# Altium schematic sheet AFPGA.SchDoc: Application FPGA
size 594 x 420 mm; CheckedBy: T.Janicki; CompanyName: Creotech Instruments SA; DrawnBy: G.Kasprowicz; Organization: CERN; Address1: European Organization for Nuclear Research; Address2: CH-1211 Genève 23 - Switzerland; Revision: -; SheetNumber: 7; SheetTotal: 11; EDA_Number: EDA-xxxx; Projet: Simple VME FMC Carrier; ModifiedBy: -; CreateDate: 20/11/2012; CheckedDate: 23/01/2012; DivGrp: BE-CO; Designer: G.Kasprowicz; PageSetup: Record=PageOptions|CenterHorizontal=True|CenterVertical=True|PrintScale=0.67|XCorrection=1.00|YCorrection=1.00|PrintKind=1|BorderSize=5000000|LeftOffset=0|BottomOffset=0|Orientation=2|PaperLength=1000|PaperWidth=1000|Scale=100|PaperSource=15|PrintQuality=600|MediaType=1|DitherType=10|PaperKind=A3|PrintScaleMode=1; ModifiedDate: -
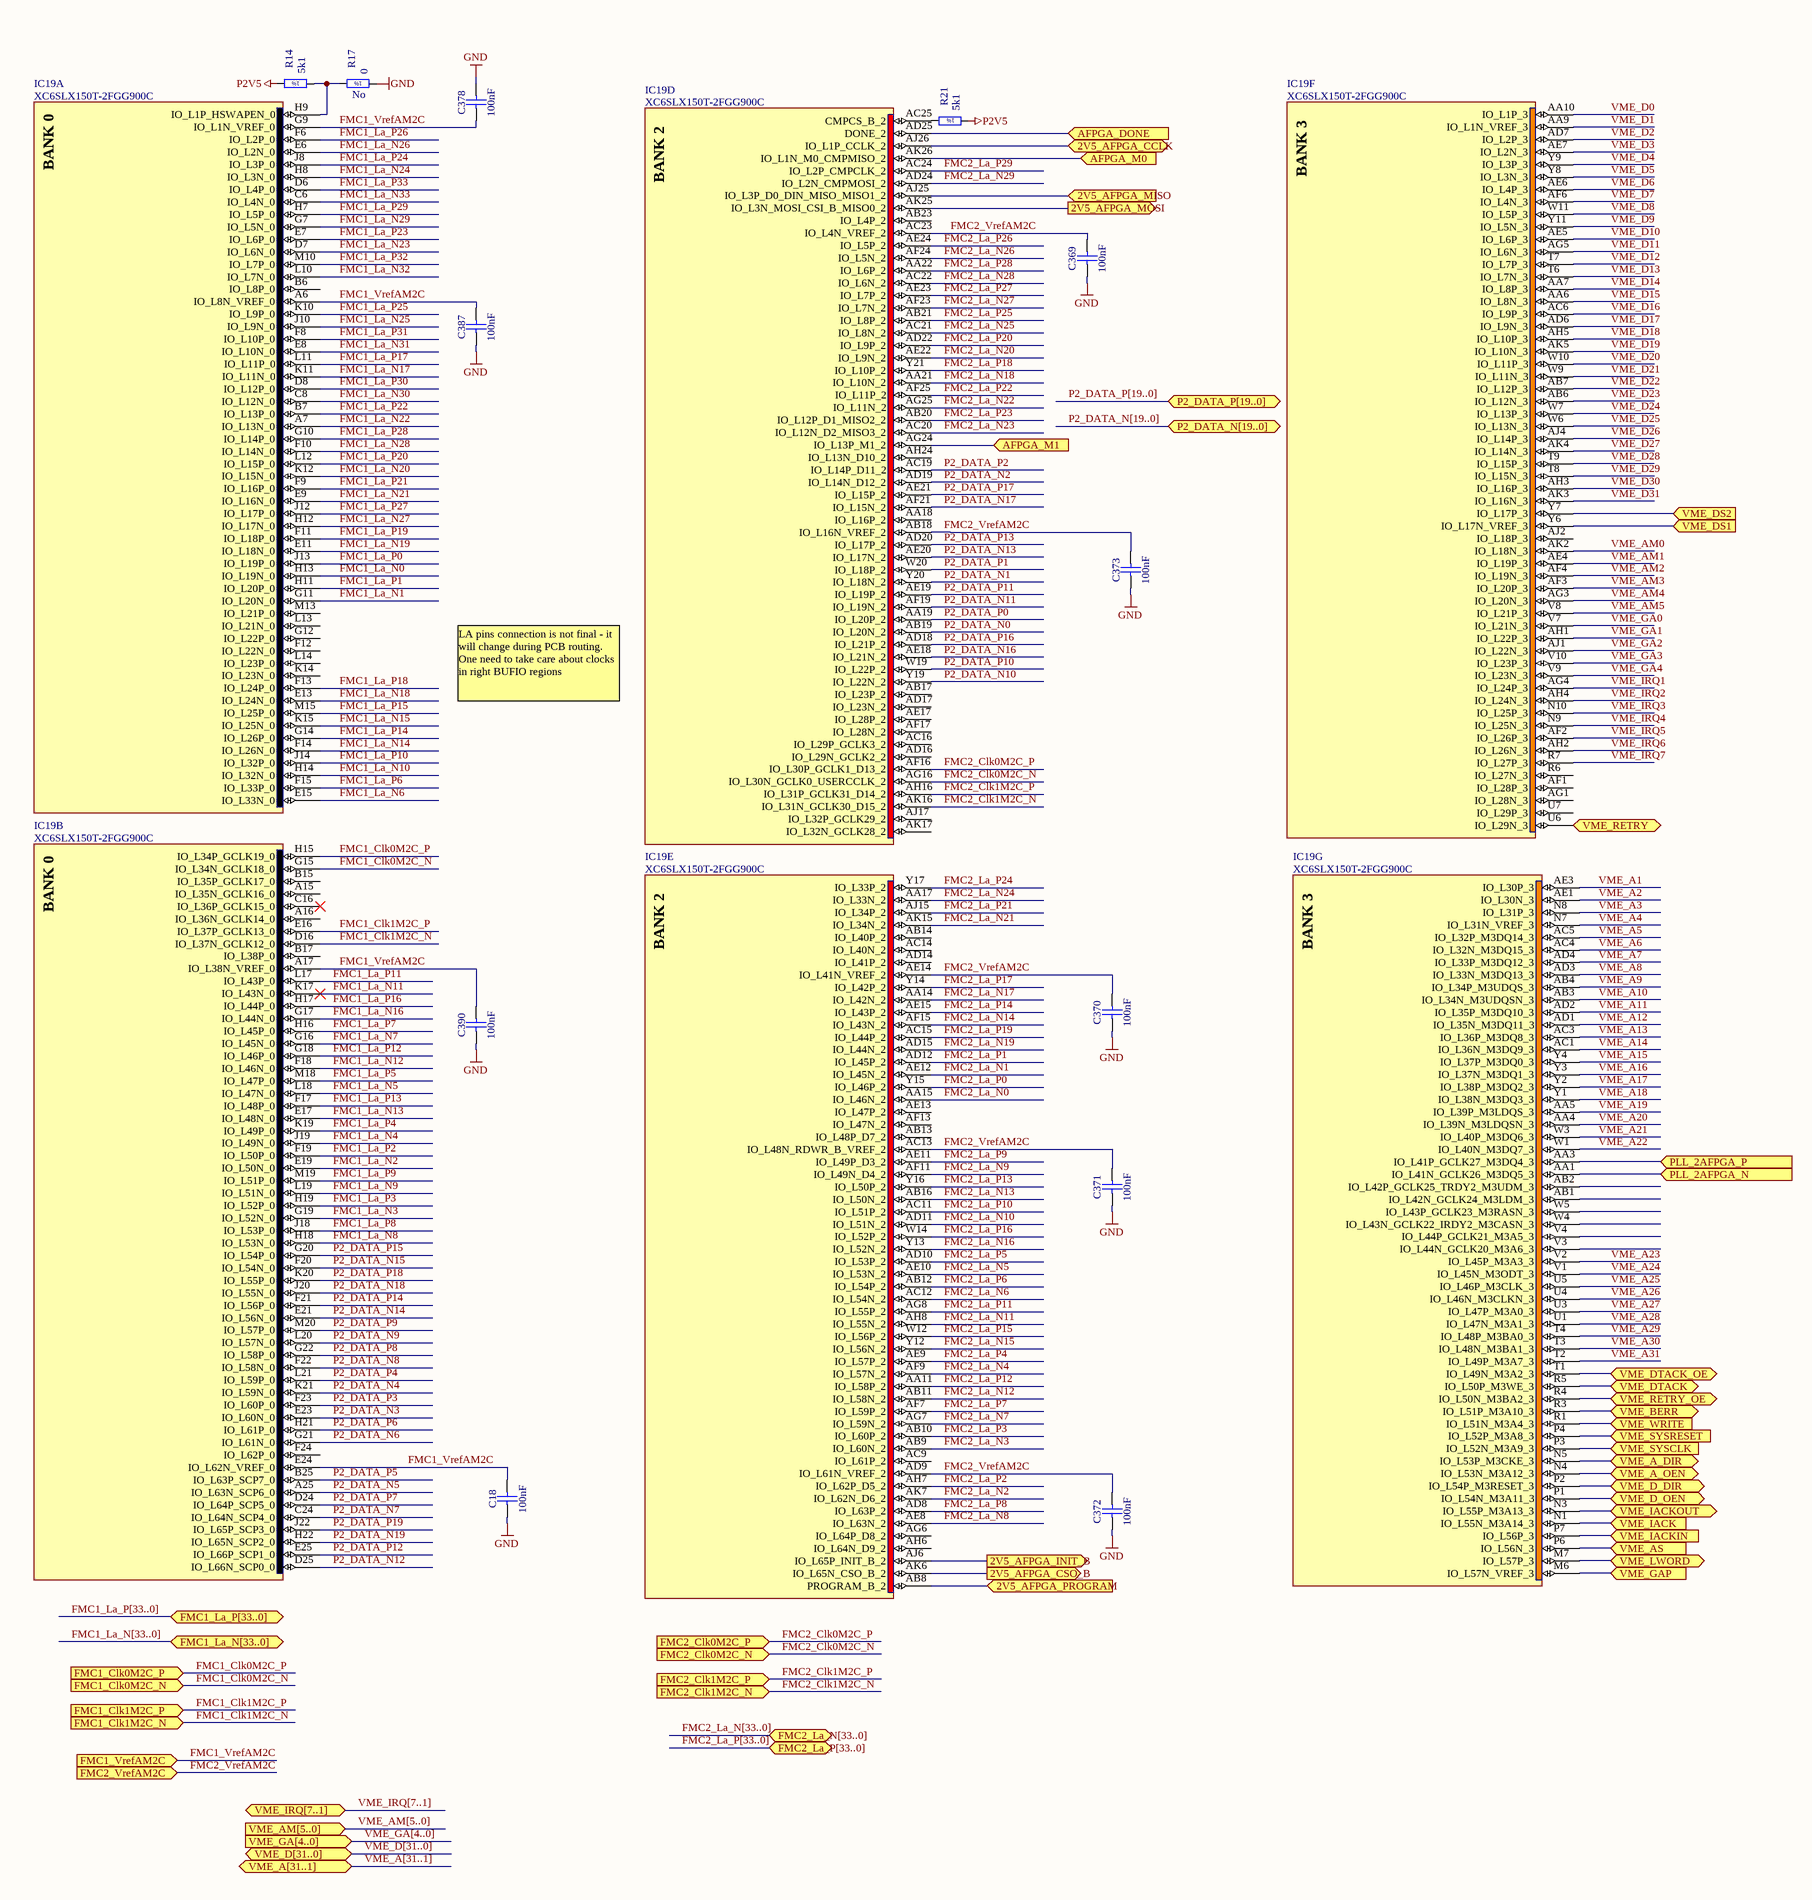
[diagram p0: AFPGA.SchDoc, left]
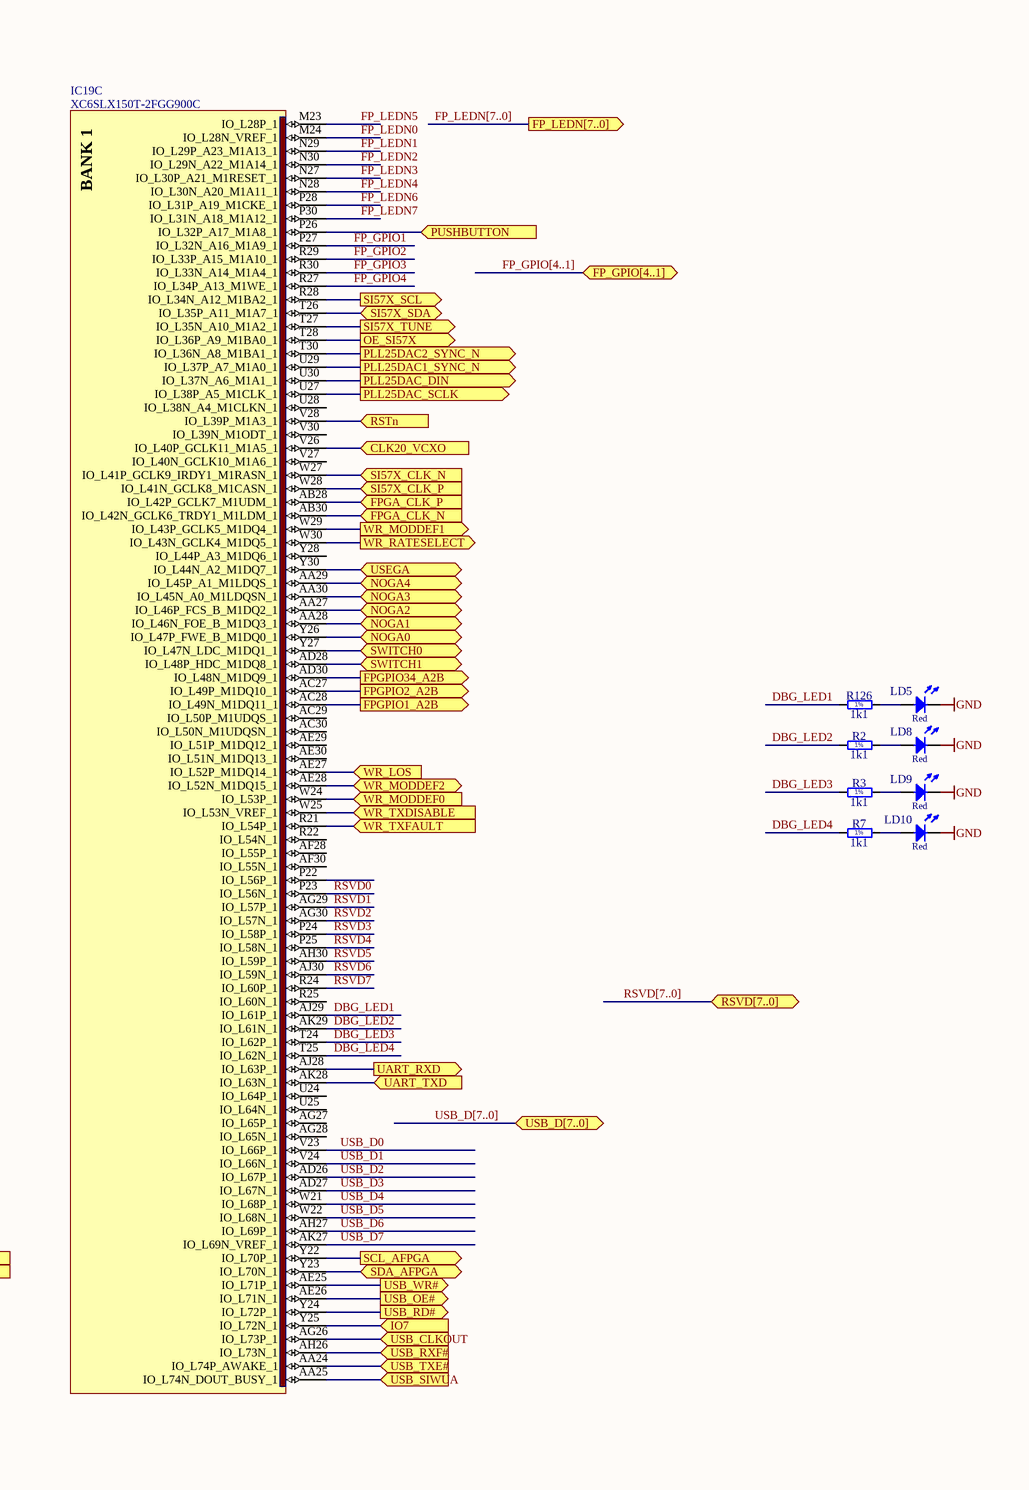
[diagram p1: AFPGA.SchDoc, right]

## Parts
C18  100nF  [CAPC1005X55N]
C369  100nF  [CAPC1005X55N]
C370  100nF  [CAPC1005X55N]
C371  100nF  [CAPC1005X55N]
C372  100nF  [CAPC1005X55N]
C373  100nF  [CAPC1005X55N]
C378  100nF  [CAPC1005X55N]
C387  100nF  [CAPC1005X55N]
C390  100nF  [CAPC1005X55N]
IC19  XC6SLX150T-2FGG900C  [BGA900C100P30X30_3100X3100X260]  (parts A,B,C,D,E,F,G of 18)
LD5  Red  [LEDC1608X80N_RED]  (value not drawn)
LD8  Red  [LEDC1608X80N_RED]  (value not drawn)
LD9  Red  [LEDC1608X80N_RED]  (value not drawn)
LD10  Red  [LEDC1608X80N_RED]  (value not drawn)
R2  1k1  [RESC1608X55N]
R3  1k1  [RESC1608X55N]
R7  1k1  [RESC1608X55N]
R14  5k1  [RESC1608X55N]
R17  0  Mounted: No  [RESC1608X55N]
R21  5k1  [RESC1608X55N]
R126  1k1  [RESC1608X55N]

## Ports
2V5_AFPGA_CCLK (bidir), 2V5_AFPGA_CSO_B (out), 2V5_AFPGA_INIT_B (out), 2V5_AFPGA_MISO (in), 2V5_AFPGA_MOSI (out), 2V5_AFPGA_PROGRAM (in), AFPGA_DONE (in), AFPGA_M0 (in), AFPGA_M1 (in), CLK20_VCXO (in), FMC1_Clk0M2C_N (in), FMC1_Clk0M2C_P (in), FMC1_Clk1M2C_N (in), FMC1_Clk1M2C_P (in), FMC1_La_N[33..0] (bidir), FMC1_La_P[33..0] (bidir), FMC1_VrefAM2C (in), FMC2_Clk0M2C_N (in), FMC2_Clk0M2C_P (in), FMC2_Clk1M2C_N (in), FMC2_Clk1M2C_P (in), FMC2_La_N[33..0] (bidir), FMC2_La_P[33..0] (bidir), FMC2_VrefAM2C (in), FP_GPIO[4..1] (bidir), FP_LEDN[7..0] (out), FPGA_CLK_N (in), FPGA_CLK_P (in), FPGPIO1_A2B (out), FPGPIO2_A2B (out), FPGPIO34_A2B (out), IO7 (in), NOGA0 (bidir), NOGA1 (bidir), NOGA2 (bidir), NOGA3 (bidir), NOGA4 (bidir), OE_SI57X (out), P2_DATA_N[19..0] (bidir), P2_DATA_P[19..0] (bidir), PLL25DAC1_SYNC_N (out), PLL25DAC2_SYNC_N (out), PLL25DAC_DIN (out), PLL25DAC_SCLK (out), PLL_2AFPGA_N (in), PLL_2AFPGA_P (in), PUSHBUTTON (in), RSTn (in), RSVD[7..0] (bidir), SCL_AFPGA (out), SDA_AFPGA (bidir), SI57X_CLK_N (in), SI57X_CLK_P (in), SI57X_SCL (out), SI57X_SDA (bidir), SI57X_TUNE (out), SWITCH0 (bidir), SWITCH1 (bidir), UART_RXD (out), UART_TXD (in), USB_CLKOUT (in), USB_D[7..0] (bidir), USB_OE# (out), USB_RD# (out), USB_RXF# (in), USB_SIWUA (in), USB_TXE# (in), USB_WR# (out), USEGA (bidir), VME_A[31..1] (bidir), VME_A_DIR (bidir), VME_A_OEN (bidir), VME_AM[5..0] (in), VME_AS (in), VME_BERR (bidir), VME_D[31..0] (bidir), VME_D_DIR (bidir), VME_D_OEN (bidir), VME_DS1 (in), VME_DS2 (in), VME_DTACK (bidir), VME_DTACK_OE (bidir), VME_GA[4..0] (in), VME_GAP (in), VME_IACK (in), VME_IACKIN (in), VME_IACKOUT (bidir), VME_IRQ[7..1] (bidir), VME_LWORD (bidir), VME_RETRY (in), VME_RETRY_OE (bidir), VME_SYSCLK (in), VME_SYSRESET (in), VME_WRITE (in), WR_LOS (in), WR_MODDEF0 (in), WR_MODDEF1 (out), WR_MODDEF2 (bidir), WR_RATESELECT (out), WR_TXDISABLE (in), WR_TXFAULT (in)

## Nets
GND: C18.1 C369.1 C370.1 C371.1 C372.1 C373.1 C378.2 C387.1 C390.1 LD5.1(C) LD8.1(C) LD9.1(C) LD10.1(C) R17.1
P2V5: R14.2 R21.1
2V5_AFPGA_CCLK: IC19.AJ26(IO_L1P_CCLK_2) ; port 2V5_AFPGA_CCLK
2V5_AFPGA_CSO_B: IC19.AK6(IO_L65N_CSO_B_2) ; port 2V5_AFPGA_CSO_B
2V5_AFPGA_INIT_B: IC19.AJ6(IO_L65P_INIT_B_2) ; port 2V5_AFPGA_INIT_B
2V5_AFPGA_MISO: IC19.AJ25(IO_L3P_D0_DIN_MISO_MISO1_2) ; port 2V5_AFPGA_MISO
2V5_AFPGA_MOSI: IC19.AK25(IO_L3N_MOSI_CSI_B_MISO0_2) ; port 2V5_AFPGA_MOSI
2V5_AFPGA_PROGRAM: IC19.AB8(PROGRAM_B_2) ; port 2V5_AFPGA_PROGRAM
AFPGA_DONE: IC19.AD25(DONE_2) ; port AFPGA_DONE
AFPGA_M0: IC19.AK26(IO_L1N_M0_CMPMISO_2) ; port AFPGA_M0
AFPGA_M1: IC19.AG24(IO_L13P_M1_2) ; port AFPGA_M1
CLK20_VCXO: IC19.V26(IO_L40P_GCLK11_M1A5_1) ; port CLK20_VCXO
DBG_LED1: IC19.AJ29(IO_L61P_1) R126.1
DBG_LED2: IC19.AK29(IO_L61N_1) R2.1
DBG_LED3: IC19.T24(IO_L62P_1) R3.1
DBG_LED4: IC19.T25(IO_L62N_1) R7.1
FMC1_Clk0M2C_N: IC19.G15(IO_L34N_GCLK18_0) ; port FMC1_Clk0M2C_N
FMC1_Clk0M2C_P: IC19.H15(IO_L34P_GCLK19_0) ; port FMC1_Clk0M2C_P
FMC1_Clk1M2C_N: IC19.D16(IO_L37N_GCLK12_0) ; port FMC1_Clk1M2C_N
FMC1_Clk1M2C_P: IC19.E16(IO_L37P_GCLK13_0) ; port FMC1_Clk1M2C_P
FMC1_La_N0: IC19.H13(IO_L19N_0)
FMC1_La_N1: IC19.G11(IO_L20N_0)
FMC1_La_N2: IC19.E19(IO_L50N_0)
FMC1_La_N3: IC19.G19(IO_L52N_0)
FMC1_La_N4: IC19.J19(IO_L49N_0)
FMC1_La_N5: IC19.L18(IO_L47N_0)
FMC1_La_N6: IC19.E15(IO_L33N_0)
FMC1_La_N7: IC19.G16(IO_L45N_0)
FMC1_La_N8: IC19.H18(IO_L53N_0)
FMC1_La_N9: IC19.L19(IO_L51N_0)
FMC1_La_N10: IC19.H14(IO_L32N_0)
FMC1_La_N11: IC19.K17(IO_L43N_0)
FMC1_La_N12: IC19.F18(IO_L46N_0)
FMC1_La_N13: IC19.E17(IO_L48N_0)
FMC1_La_N14: IC19.F14(IO_L26N_0)
FMC1_La_N15: IC19.K15(IO_L25N_0)
FMC1_La_N16: IC19.G17(IO_L44N_0)
FMC1_La_N17: IC19.K11(IO_L11N_0)
FMC1_La_N18: IC19.E13(IO_L24N_0)
FMC1_La_N19: IC19.E11(IO_L18N_0)
FMC1_La_N20: IC19.K12(IO_L15N_0)
FMC1_La_N21: IC19.E9(IO_L16N_0)
FMC1_La_N22: IC19.A7(IO_L13N_0)
FMC1_La_N23: IC19.D7(IO_L6N_0)
FMC1_La_N24: IC19.H8(IO_L3N_0)
FMC1_La_N25: IC19.J10(IO_L9N_0)
FMC1_La_N26: IC19.E6(IO_L2N_0)
FMC1_La_N27: IC19.H12(IO_L17N_0)
FMC1_La_N28: IC19.F10(IO_L14N_0)
FMC1_La_N29: IC19.G7(IO_L5N_0)
FMC1_La_N30: IC19.C8(IO_L12N_0)
FMC1_La_N31: IC19.E8(IO_L10N_0)
FMC1_La_N32: IC19.L10(IO_L7N_0)
FMC1_La_N33: IC19.C6(IO_L4N_0)
FMC1_La_P0: IC19.J13(IO_L19P_0)
FMC1_La_P1: IC19.H11(IO_L20P_0)
FMC1_La_P2: IC19.F19(IO_L50P_0)
FMC1_La_P3: IC19.H19(IO_L52P_0)
FMC1_La_P4: IC19.K19(IO_L49P_0)
FMC1_La_P5: IC19.M18(IO_L47P_0)
FMC1_La_P6: IC19.F15(IO_L33P_0)
FMC1_La_P7: IC19.H16(IO_L45P_0)
FMC1_La_P8: IC19.J18(IO_L53P_0)
FMC1_La_P9: IC19.M19(IO_L51P_0)
FMC1_La_P10: IC19.J14(IO_L32P_0)
FMC1_La_P11: IC19.L17(IO_L43P_0)
FMC1_La_P12: IC19.G18(IO_L46P_0)
FMC1_La_P13: IC19.F17(IO_L48P_0)
FMC1_La_P14: IC19.G14(IO_L26P_0)
FMC1_La_P15: IC19.M15(IO_L25P_0)
FMC1_La_P16: IC19.H17(IO_L44P_0)
FMC1_La_P17: IC19.L11(IO_L11P_0)
FMC1_La_P18: IC19.F13(IO_L24P_0)
FMC1_La_P19: IC19.F11(IO_L18P_0)
FMC1_La_P20: IC19.L12(IO_L15P_0)
FMC1_La_P21: IC19.F9(IO_L16P_0)
FMC1_La_P22: IC19.B7(IO_L13P_0)
FMC1_La_P23: IC19.E7(IO_L6P_0)
FMC1_La_P24: IC19.J8(IO_L3P_0)
FMC1_La_P25: IC19.K10(IO_L9P_0)
FMC1_La_P26: IC19.F6(IO_L2P_0)
FMC1_La_P27: IC19.J12(IO_L17P_0)
FMC1_La_P28: IC19.G10(IO_L14P_0)
FMC1_La_P29: IC19.H7(IO_L5P_0)
FMC1_La_P30: IC19.D8(IO_L12P_0)
FMC1_La_P31: IC19.F8(IO_L10P_0)
FMC1_La_P32: IC19.M10(IO_L7P_0)
FMC1_La_P33: IC19.D6(IO_L4P_0)
FMC1_VrefAM2C: C18.2 C378.1 C387.2 C390.2 IC19.A6(IO_L8N_VREF_0) IC19.A17(IO_L38N_VREF_0) IC19.E24(IO_L62N_VREF_0) IC19.G9(IO_L1N_VREF_0) ; port FMC1_VrefAM2C
FMC2_Clk0M2C_N: IC19.AG16(IO_L30N_GCLK0_USERCCLK_2) ; port FMC2_Clk0M2C_N
FMC2_Clk0M2C_P: IC19.AF16(IO_L30P_GCLK1_D13_2) ; port FMC2_Clk0M2C_P
FMC2_Clk1M2C_N: IC19.AK16(IO_L31N_GCLK30_D15_2) ; port FMC2_Clk1M2C_N
FMC2_Clk1M2C_P: IC19.AH16(IO_L31P_GCLK31_D14_2) ; port FMC2_Clk1M2C_P
FMC2_La_N0: IC19.AA15(IO_L46N_2)
FMC2_La_N1: IC19.AE12(IO_L45N_2)
FMC2_La_N2: IC19.AK7(IO_L62N_D6_2)
FMC2_La_N3: IC19.AB9(IO_L60N_2)
FMC2_La_N4: IC19.AF9(IO_L57N_2)
FMC2_La_N5: IC19.AE10(IO_L53N_2)
FMC2_La_N6: IC19.AC12(IO_L54N_2)
FMC2_La_N7: IC19.AG7(IO_L59N_2)
FMC2_La_N8: IC19.AE8(IO_L63N_2)
FMC2_La_N9: IC19.AF11(IO_L49N_D4_2)
FMC2_La_N10: IC19.AD11(IO_L51N_2)
FMC2_La_N11: IC19.AH8(IO_L55N_2)
FMC2_La_N12: IC19.AB11(IO_L58N_2)
FMC2_La_N13: IC19.AB16(IO_L50N_2)
FMC2_La_N14: IC19.AF15(IO_L43N_2)
FMC2_La_N15: IC19.Y12(IO_L56N_2)
FMC2_La_N16: IC19.Y13(IO_L52N_2)
FMC2_La_N17: IC19.AA14(IO_L42N_2)
FMC2_La_N18: IC19.AA21(IO_L10N_2)
FMC2_La_N19: IC19.AD15(IO_L44N_2)
FMC2_La_N20: IC19.AE22(IO_L9N_2)
FMC2_La_N21: IC19.AK15(IO_L34N_2)
FMC2_La_N22: IC19.AG25(IO_L11N_2)
FMC2_La_N23: IC19.AC20(IO_L12N_D2_MISO3_2)
FMC2_La_N24: IC19.AA17(IO_L33N_2)
FMC2_La_N25: IC19.AC21(IO_L8N_2)
FMC2_La_N26: IC19.AF24(IO_L5N_2)
FMC2_La_N27: IC19.AF23(IO_L7N_2)
FMC2_La_N28: IC19.AC22(IO_L6N_2)
FMC2_La_N29: IC19.AD24(IO_L2N_CMPMOSI_2)
FMC2_La_P0: IC19.Y15(IO_L46P_2)
FMC2_La_P1: IC19.AD12(IO_L45P_2)
FMC2_La_P2: IC19.AH7(IO_L62P_D5_2)
FMC2_La_P3: IC19.AB10(IO_L60P_2)
FMC2_La_P4: IC19.AE9(IO_L57P_2)
FMC2_La_P5: IC19.AD10(IO_L53P_2)
FMC2_La_P6: IC19.AB12(IO_L54P_2)
FMC2_La_P7: IC19.AF7(IO_L59P_2)
FMC2_La_P8: IC19.AD8(IO_L63P_2)
FMC2_La_P9: IC19.AE11(IO_L49P_D3_2)
FMC2_La_P10: IC19.AC11(IO_L51P_2)
FMC2_La_P11: IC19.AG8(IO_L55P_2)
FMC2_La_P12: IC19.AA11(IO_L58P_2)
FMC2_La_P13: IC19.Y16(IO_L50P_2)
FMC2_La_P14: IC19.AE15(IO_L43P_2)
FMC2_La_P15: IC19.W12(IO_L56P_2)
FMC2_La_P16: IC19.W14(IO_L52P_2)
FMC2_La_P17: IC19.Y14(IO_L42P_2)
FMC2_La_P18: IC19.Y21(IO_L10P_2)
FMC2_La_P19: IC19.AC15(IO_L44P_2)
FMC2_La_P20: IC19.AD22(IO_L9P_2)
FMC2_La_P21: IC19.AJ15(IO_L34P_2)
FMC2_La_P22: IC19.AF25(IO_L11P_2)
FMC2_La_P23: IC19.AB20(IO_L12P_D1_MISO2_2)
FMC2_La_P24: IC19.Y17(IO_L33P_2)
FMC2_La_P25: IC19.AB21(IO_L8P_2)
FMC2_La_P26: IC19.AE24(IO_L5P_2)
FMC2_La_P27: IC19.AE23(IO_L7P_2)
FMC2_La_P28: IC19.AA22(IO_L6P_2)
FMC2_La_P29: IC19.AC24(IO_L2P_CMPCLK_2)
FMC2_VrefAM2C: C369.2 C370.2 C371.2 C372.2 C373.2 IC19.AB18(IO_L16N_VREF_2) IC19.AC13(IO_L48N_RDWR_B_VREF_2) IC19.AC23(IO_L4N_VREF_2) IC19.AD9(IO_L61N_VREF_2) IC19.AE14(IO_L41N_VREF_2) ; port FMC2_VrefAM2C
FP_GPIO1: IC19.P27(IO_L32N_A16_M1A9_1)
FP_GPIO2: IC19.R29(IO_L33P_A15_M1A10_1)
FP_GPIO3: IC19.R30(IO_L33N_A14_M1A4_1)
FP_GPIO4: IC19.R27(IO_L34P_A13_M1WE_1)
FP_LEDN0: IC19.M24(IO_L28N_VREF_1)
FP_LEDN1: IC19.N29(IO_L29P_A23_M1A13_1)
FP_LEDN2: IC19.N30(IO_L29N_A22_M1A14_1)
FP_LEDN3: IC19.N27(IO_L30P_A21_M1RESET_1)
FP_LEDN4: IC19.N28(IO_L30N_A20_M1A11_1)
FP_LEDN5: IC19.M23(IO_L28P_1)
FP_LEDN6: IC19.P28(IO_L31P_A19_M1CKE_1)
FP_LEDN7: IC19.P30(IO_L31N_A18_M1A12_1)
FPGA_CLK_N: IC19.AB30(IO_L42N_GCLK6_TRDY1_M1LDM_1) ; port FPGA_CLK_N
FPGA_CLK_P: IC19.AB28(IO_L42P_GCLK7_M1UDM_1) ; port FPGA_CLK_P
FPGPIO1_A2B: IC19.AC28(IO_L49N_M1DQ11_1) ; port FPGPIO1_A2B
FPGPIO2_A2B: IC19.AC27(IO_L49P_M1DQ10_1) ; port FPGPIO2_A2B
FPGPIO34_A2B: IC19.AD30(IO_L48N_M1DQ9_1) ; port FPGPIO34_A2B
IO7: IC19.Y25(IO_L72N_1) ; port IO7
NOGA0: IC19.Y26(IO_L47P_FWE_B_M1DQ0_1) ; port NOGA0
NOGA1: IC19.AA28(IO_L46N_FOE_B_M1DQ3_1) ; port NOGA1
NOGA2: IC19.AA27(IO_L46P_FCS_B_M1DQ2_1) ; port NOGA2
NOGA3: IC19.AA30(IO_L45N_A0_M1LDQSN_1) ; port NOGA3
NOGA4: IC19.AA29(IO_L45P_A1_M1LDQS_1) ; port NOGA4
OE_SI57X: IC19.T28(IO_L36P_A9_M1BA0_1) ; port OE_SI57X
P2_DATA_N0: IC19.AB19(IO_L20N_2)
P2_DATA_N1: IC19.Y20(IO_L18N_2)
P2_DATA_N2: IC19.AD19(IO_L14N_D12_2)
P2_DATA_N3: IC19.E23(IO_L60N_0)
P2_DATA_N4: IC19.K21(IO_L59N_0)
P2_DATA_N5: IC19.A25(IO_L63N_SCP6_0)
P2_DATA_N6: IC19.G21(IO_L61N_0)
P2_DATA_N7: IC19.C24(IO_L64N_SCP4_0)
P2_DATA_N8: IC19.F22(IO_L58N_0)
P2_DATA_N9: IC19.L20(IO_L57N_0)
P2_DATA_N10: IC19.Y19(IO_L22N_2)
P2_DATA_N11: IC19.AF19(IO_L19N_2)
P2_DATA_N12: IC19.D25(IO_L66N_SCP0_0)
P2_DATA_N13: IC19.AE20(IO_L17N_2)
P2_DATA_N14: IC19.E21(IO_L56N_0)
P2_DATA_N15: IC19.F20(IO_L54N_0)
P2_DATA_N16: IC19.AE18(IO_L21N_2)
P2_DATA_N17: IC19.AF21(IO_L15N_2)
P2_DATA_N18: IC19.J20(IO_L55N_0)
P2_DATA_N19: IC19.H22(IO_L65N_SCP2_0)
P2_DATA_P0: IC19.AA19(IO_L20P_2)
P2_DATA_P1: IC19.W20(IO_L18P_2)
P2_DATA_P2: IC19.AC19(IO_L14P_D11_2)
P2_DATA_P3: IC19.F23(IO_L60P_0)
P2_DATA_P4: IC19.L21(IO_L59P_0)
P2_DATA_P5: IC19.B25(IO_L63P_SCP7_0)
P2_DATA_P6: IC19.H21(IO_L61P_0)
P2_DATA_P7: IC19.D24(IO_L64P_SCP5_0)
P2_DATA_P8: IC19.G22(IO_L58P_0)
P2_DATA_P9: IC19.M20(IO_L57P_0)
P2_DATA_P10: IC19.W19(IO_L22P_2)
P2_DATA_P11: IC19.AE19(IO_L19P_2)
P2_DATA_P12: IC19.E25(IO_L66P_SCP1_0)
P2_DATA_P13: IC19.AD20(IO_L17P_2)
P2_DATA_P14: IC19.F21(IO_L56P_0)
P2_DATA_P15: IC19.G20(IO_L54P_0)
P2_DATA_P16: IC19.AD18(IO_L21P_2)
P2_DATA_P17: IC19.AE21(IO_L15P_2)
P2_DATA_P18: IC19.K20(IO_L55P_0)
P2_DATA_P19: IC19.J22(IO_L65P_SCP3_0)
PLL25DAC1_SYNC_N: IC19.U29(IO_L37P_A7_M1A0_1) ; port PLL25DAC1_SYNC_N
PLL25DAC2_SYNC_N: IC19.T30(IO_L36N_A8_M1BA1_1) ; port PLL25DAC2_SYNC_N
PLL25DAC_DIN: IC19.U30(IO_L37N_A6_M1A1_1) ; port PLL25DAC_DIN
PLL25DAC_SCLK: IC19.U27(IO_L38P_A5_M1CLK_1) ; port PLL25DAC_SCLK
PLL_2AFPGA_N: IC19.AA1(IO_L41N_GCLK26_M3DQ5_3) ; port PLL_2AFPGA_N
PLL_2AFPGA_P: IC19.AA3(IO_L41P_GCLK27_M3DQ4_3) ; port PLL_2AFPGA_P
PUSHBUTTON: IC19.P26(IO_L32P_A17_M1A8_1) ; port PUSHBUTTON
RSTn: IC19.V28(IO_L39P_M1A3_1) ; port RSTn
RSVD0: IC19.P23(IO_L56N_1)
RSVD1: IC19.AG29(IO_L57P_1)
RSVD2: IC19.AG30(IO_L57N_1)
RSVD3: IC19.P24(IO_L58P_1)
RSVD4: IC19.P25(IO_L58N_1)
RSVD5: IC19.AH30(IO_L59P_1)
RSVD6: IC19.AJ30(IO_L59N_1)
RSVD7: IC19.R24(IO_L60P_1)
SCL_AFPGA: IC19.Y22(IO_L70P_1) ; port SCL_AFPGA
SDA_AFPGA: IC19.Y23(IO_L70N_1) ; port SDA_AFPGA
SI57X_CLK_N: IC19.W27(IO_L41P_GCLK9_IRDY1_M1RASN_1) ; port SI57X_CLK_N
SI57X_CLK_P: IC19.W28(IO_L41N_GCLK8_M1CASN_1) ; port SI57X_CLK_P
SI57X_SCL: IC19.R28(IO_L34N_A12_M1BA2_1) ; port SI57X_SCL
SI57X_SDA: IC19.T26(IO_L35P_A11_M1A7_1) ; port SI57X_SDA
SI57X_TUNE: IC19.T27(IO_L35N_A10_M1A2_1) ; port SI57X_TUNE
SWITCH0: IC19.Y27(IO_L47N_LDC_M1DQ1_1) ; port SWITCH0
SWITCH1: IC19.AD28(IO_L48P_HDC_M1DQ8_1) ; port SWITCH1
UART_RXD: IC19.AJ28(IO_L63P_1) ; port UART_RXD
UART_TXD: IC19.AK28(IO_L63N_1) ; port UART_TXD
USB_CLKOUT: IC19.AG26(IO_L73P_1) ; port USB_CLKOUT
USB_D0: IC19.V23(IO_L66P_1)
USB_D1: IC19.V24(IO_L66N_1)
USB_D2: IC19.AD26(IO_L67P_1)
USB_D3: IC19.AD27(IO_L67N_1)
USB_D4: IC19.W21(IO_L68P_1)
USB_D5: IC19.W22(IO_L68N_1)
USB_D6: IC19.AH27(IO_L69P_1)
USB_D7: IC19.AK27(IO_L69N_VREF_1)
USB_OE#: IC19.AE26(IO_L71N_1) ; port USB_OE#
USB_RD#: IC19.Y24(IO_L72P_1) ; port USB_RD#
USB_RXF#: IC19.AH26(IO_L73N_1) ; port USB_RXF#
USB_SIWUA: IC19.AA25(IO_L74N_DOUT_BUSY_1) ; port USB_SIWUA
USB_TXE#: IC19.AA24(IO_L74P_AWAKE_1) ; port USB_TXE#
USB_WR#: IC19.AE25(IO_L71P_1) ; port USB_WR#
USEGA: IC19.Y30(IO_L44N_A2_M1DQ7_1) ; port USEGA
VME_A1: IC19.AE3(IO_L30P_3)
VME_A2: IC19.AE1(IO_L30N_3)
VME_A3: IC19.N8(IO_L31P_3)
VME_A4: IC19.N7(IO_L31N_VREF_3)
VME_A5: IC19.AC5(IO_L32P_M3DQ14_3)
VME_A6: IC19.AC4(IO_L32N_M3DQ15_3)
VME_A7: IC19.AD4(IO_L33P_M3DQ12_3)
VME_A8: IC19.AD3(IO_L33N_M3DQ13_3)
VME_A9: IC19.AB4(IO_L34P_M3UDQS_3)
VME_A10: IC19.AB3(IO_L34N_M3UDQSN_3)
VME_A11: IC19.AD2(IO_L35P_M3DQ10_3)
VME_A12: IC19.AD1(IO_L35N_M3DQ11_3)
VME_A13: IC19.AC3(IO_L36P_M3DQ8_3)
VME_A14: IC19.AC1(IO_L36N_M3DQ9_3)
VME_A15: IC19.Y4(IO_L37P_M3DQ0_3)
VME_A16: IC19.Y3(IO_L37N_M3DQ1_3)
VME_A17: IC19.Y2(IO_L38P_M3DQ2_3)
VME_A18: IC19.Y1(IO_L38N_M3DQ3_3)
VME_A19: IC19.AA5(IO_L39P_M3LDQS_3)
VME_A20: IC19.AA4(IO_L39N_M3LDQSN_3)
VME_A21: IC19.W3(IO_L40P_M3DQ6_3)
VME_A22: IC19.W1(IO_L40N_M3DQ7_3)
VME_A23: IC19.V2(IO_L45P_M3A3_3)
VME_A24: IC19.V1(IO_L45N_M3ODT_3)
VME_A25: IC19.U5(IO_L46P_M3CLK_3)
VME_A26: IC19.U4(IO_L46N_M3CLKN_3)
VME_A27: IC19.U3(IO_L47P_M3A0_3)
VME_A28: IC19.U1(IO_L47N_M3A1_3)
VME_A29: IC19.T4(IO_L48P_M3BA0_3)
VME_A30: IC19.T3(IO_L48N_M3BA1_3)
VME_A31: IC19.T2(IO_L49P_M3A7_3)
VME_A_DIR: IC19.N5(IO_L53P_M3CKE_3) ; port VME_A_DIR
VME_A_OEN: IC19.N4(IO_L53N_M3A12_3) ; port VME_A_OEN
VME_AM0: IC19.AK2(IO_L18N_3)
VME_AM1: IC19.AE4(IO_L19P_3)
VME_AM2: IC19.AF4(IO_L19N_3)
VME_AM3: IC19.AF3(IO_L20P_3)
VME_AM4: IC19.AG3(IO_L20N_3)
VME_AM5: IC19.V8(IO_L21P_3)
VME_AS: IC19.P6(IO_L56N_3) ; port VME_AS
VME_BERR: IC19.R3(IO_L51P_M3A10_3) ; port VME_BERR
VME_D0: IC19.AA10(IO_L1P_3)
VME_D1: IC19.AA9(IO_L1N_VREF_3)
VME_D2: IC19.AD7(IO_L2P_3)
VME_D3: IC19.AE7(IO_L2N_3)
VME_D4: IC19.Y9(IO_L3P_3)
VME_D5: IC19.Y8(IO_L3N_3)
VME_D6: IC19.AE6(IO_L4P_3)
VME_D7: IC19.AF6(IO_L4N_3)
VME_D8: IC19.W11(IO_L5P_3)
VME_D9: IC19.Y11(IO_L5N_3)
VME_D10: IC19.AE5(IO_L6P_3)
VME_D11: IC19.AG5(IO_L6N_3)
VME_D12: IC19.T7(IO_L7P_3)
VME_D13: IC19.T6(IO_L7N_3)
VME_D14: IC19.AA7(IO_L8P_3)
VME_D15: IC19.AA6(IO_L8N_3)
VME_D16: IC19.AC6(IO_L9P_3)
VME_D17: IC19.AD6(IO_L9N_3)
VME_D18: IC19.AH5(IO_L10P_3)
VME_D19: IC19.AK5(IO_L10N_3)
VME_D20: IC19.W10(IO_L11P_3)
VME_D21: IC19.W9(IO_L11N_3)
VME_D22: IC19.AB7(IO_L12P_3)
VME_D23: IC19.AB6(IO_L12N_3)
VME_D24: IC19.W7(IO_L13P_3)
VME_D25: IC19.W6(IO_L13N_3)
VME_D26: IC19.AJ4(IO_L14P_3)
VME_D27: IC19.AK4(IO_L14N_3)
VME_D28: IC19.T9(IO_L15P_3)
VME_D29: IC19.T8(IO_L15N_3)
VME_D30: IC19.AH3(IO_L16P_3)
VME_D31: IC19.AK3(IO_L16N_3)
VME_D_DIR: IC19.P2(IO_L54P_M3RESET_3) ; port VME_D_DIR
VME_D_OEN: IC19.P1(IO_L54N_M3A11_3) ; port VME_D_OEN
VME_DS1: IC19.Y6(IO_L17N_VREF_3) ; port VME_DS1
VME_DS2: IC19.Y7(IO_L17P_3) ; port VME_DS2
VME_DTACK: IC19.R5(IO_L50P_M3WE_3) ; port VME_DTACK
VME_DTACK_OE: IC19.T1(IO_L49N_M3A2_3) ; port VME_DTACK_OE
VME_GA0: IC19.V7(IO_L21N_3)
VME_GA1: IC19.AH1(IO_L22P_3)
VME_GA2: IC19.AJ1(IO_L22N_3)
VME_GA3: IC19.V10(IO_L23P_3)
VME_GA4: IC19.V9(IO_L23N_3)
VME_GAP: IC19.M6(IO_L57N_VREF_3) ; port VME_GAP
VME_IACK: IC19.N1(IO_L55N_M3A14_3) ; port VME_IACK
VME_IACKIN: IC19.P7(IO_L56P_3) ; port VME_IACKIN
VME_IACKOUT: IC19.N3(IO_L55P_M3A13_3) ; port VME_IACKOUT
VME_IRQ1: IC19.AG4(IO_L24P_3)
VME_IRQ2: IC19.AH4(IO_L24N_3)
VME_IRQ3: IC19.N10(IO_L25P_3)
VME_IRQ4: IC19.N9(IO_L25N_3)
VME_IRQ5: IC19.AF2(IO_L26P_3)
VME_IRQ6: IC19.AH2(IO_L26N_3)
VME_IRQ7: IC19.R7(IO_L27P_3)
VME_LWORD: IC19.M7(IO_L57P_3) ; port VME_LWORD
VME_RETRY: IC19.U6(IO_L29N_3) ; port VME_RETRY
VME_RETRY_OE: IC19.R4(IO_L50N_M3BA2_3) ; port VME_RETRY_OE
VME_SYSCLK: IC19.P3(IO_L52N_M3A9_3) ; port VME_SYSCLK
VME_SYSRESET: IC19.P4(IO_L52P_M3A8_3) ; port VME_SYSRESET
VME_WRITE: IC19.R1(IO_L51N_M3A4_3) ; port VME_WRITE
WR_LOS: IC19.AE27(IO_L52P_M1DQ14_1) ; port WR_LOS
WR_MODDEF0: IC19.W24(IO_L53P_1) ; port WR_MODDEF0
WR_MODDEF1: IC19.W29(IO_L43P_GCLK5_M1DQ4_1) ; port WR_MODDEF1
WR_MODDEF2: IC19.AE28(IO_L52N_M1DQ15_1) ; port WR_MODDEF2
WR_RATESELECT: IC19.W30(IO_L43N_GCLK4_M1DQ5_1) ; port WR_RATESELECT
WR_TXDISABLE: IC19.W25(IO_L53N_VREF_1) ; port WR_TXDISABLE
WR_TXFAULT: IC19.R21(IO_L54P_1) ; port WR_TXFAULT
NetIC19_AC25: IC19.AC25(CMPCS_B_2) R21.2
NetIC19_H9: IC19.H9(IO_L1P_HSWAPEN_0) R14.1 R17.2
NetLD5_2: LD5.2(A) R126.2
NetLD8_2: LD8.2(A) R2.2
NetLD9_2: LD9.2(A) R3.2
NetLD10_2: LD10.2(A) R7.2

Not connected (* = marked no-connect by the designer): IC19 A15(IO_L35N_GCLK16_0) A16(IO_L36N_GCLK14_0) AA18(IO_L16P_2) AB1(IO_L42N_GCLK24_M3LDM_3) AB2(IO_L42P_GCLK25_TRDY2_M3UDM_3) AB13(IO_L48P_D7_2) AB14(IO_L40P_2) AB17(IO_L23P_2) AB23(IO_L4P_2) AC9(IO_L61P_2) AC14(IO_L40N_2) AC16(IO_L29P_GCLK3_2) AC29(IO_L50P_M1UDQS_1) AC30(IO_L50N_M1UDQSN_1) AD14(IO_L41P_2) AD16(IO_L29N_GCLK2_2) AD17(IO_L23N_2) AE13(IO_L47P_2) AE17(IO_L28P_2) AE29(IO_L51P_M1DQ12_1) AE30(IO_L51N_M1DQ13_1) AF1(IO_L28P_3) AF13(IO_L47N_2) AF17(IO_L28N_2) AF28(IO_L55P_1) AF30(IO_L55N_1) AG1(IO_L28N_3) AG6(IO_L64P_D8_2) AG27(IO_L65P_1) AG28(IO_L65N_1) AH6(IO_L64N_D9_2) AH24(IO_L13N_D10_2) AJ2(IO_L18P_3) AJ17(IO_L32P_GCLK29_2) AK17(IO_L32N_GCLK28_2) B6(IO_L8P_0) B15(IO_L35P_GCLK17_0) B17(IO_L38P_0) C16(IO_L36P_GCLK15_0)* F12(IO_L22N_0) F24(IO_L62P_0) G12(IO_L22P_0) K14(IO_L23N_0) L13(IO_L21N_0) L14(IO_L23P_0) M13(IO_L21P_0) P22(IO_L56P_1) R6(IO_L27N_3) R22(IO_L54N_1) R25(IO_L60N_1) U7(IO_L29P_3) U24(IO_L64P_1) U25(IO_L64N_1) U28(IO_L38N_A4_M1CLKN_1) V3(IO_L44N_GCLK20_M3A6_3) V4(IO_L44P_GCLK21_M3A5_3) V27(IO_L40N_GCLK10_M1A6_1) V30(IO_L39N_M1ODT_1) W4(IO_L43N_GCLK22_IRDY2_M3CASN_3) W5(IO_L43P_GCLK23_M3RASN_3) Y28(IO_L44P_A3_M1DQ6_1)

## Buses and harness runs
bus FMC1_La_N[33..0] = port FMC1_La_N[33..0]
bus FMC1_La_P[33..0] = port FMC1_La_P[33..0]
bus FMC2_La_N[33..0] = port FMC2_La_N[33..0]
bus FMC2_La_P[33..0] = port FMC2_La_P[33..0]
bus FP_GPIO[4..1] = port FP_GPIO[4..1]
bus FP_LEDN[7..0] = port FP_LEDN[7..0]
bus P2_DATA_N[19..0] = port P2_DATA_N[19..0]
bus P2_DATA_P[19..0] = port P2_DATA_P[19..0]
bus RSVD[7..0] = port RSVD[7..0]
bus USB_D[7..0] = port USB_D[7..0]
bus VME_A[31..1] = port VME_A[31..1]
bus VME_AM[5..0] = port VME_AM[5..0]
bus VME_D[31..0] = port VME_D[31..0]
bus VME_GA[4..0] = port VME_GA[4..0]
bus VME_IRQ[7..1] = port VME_IRQ[7..1]

## Notes on the sheet
- LA pins connection is not final - it will change during PCB routing. One need to take care about clocks in right BUFIO regions
- Project/Equipment
- Document
- File
- Designer
- Drawn by
- Check.by
- Last Mod.
- Print Date
- Sheet
- Size
- A2
- of
- Rev
- (in symbol R0603_0R_JUMPER) 1%
- (in symbol R0603_1K1_1%_0.1W_100PPM) 1%
- (in symbol R0603_5K1_1%_0.1W_100PPM) 1%
- (in symbol XC6SLX150T-2FGG900C, part A) BANK 0
- (in symbol XC6SLX150T-2FGG900C, part B) BANK 0
- (in symbol XC6SLX150T-2FGG900C, part C) BANK 1
- (in symbol XC6SLX150T-2FGG900C, part D) BANK 2
- (in symbol XC6SLX150T-2FGG900C, part E) BANK 2
- (in symbol XC6SLX150T-2FGG900C, part F) BANK 3
- (in symbol XC6SLX150T-2FGG900C, part G) BANK 3

## Library data of the parts
C18 C369-C373 C378 C387 C390 = CC0402_100NF_16V_10%_X7R: Non-polarised capacitor; Part Description: SMD Multilayer Chip Ceramic Capacitor; Manufacturer: GENERIC; Manufacturer1 Part Number: 223878715649; Voltage: 16V; TC: X7R; Tolerance: ±10%; Table: Capacitors SMD; Part Number: CC0402_100NF_16V_10%_X7R; Component Kind: Standard; Component Type: Standard; Pin Count: 2; Value: 100nF; Status: Not Recommended; Manufacturer Part Number: CC0402_100NF_16V_10%_X7R; Case: 0402; Mounted: Yes; Socket: No; SMD: Yes; Manufacturer1 Example: PHYCOMP; Manufacturer1 ComponentHeight: 0.55mm; HelpURL: \\cern.ch\dfs\Applications\Altium\Datasheets\CC0402_X7R_PHYCOMP.pdf; Author: CERN DEM JLC; CreateDate: 03/12/2007; LatestRevisionDate: 03/12/2007
IC19 = XC6SLX150T-2FGG900C: SPARTAN-6, FPGA, 900-Ball BGA, Commercial Grade, Pb-Free; Part Description: SPARTAN-6, FPGA, 540 User I/Os, 8 GTPs, 900-Ball BGA, Commercial Grade, Pb-Free; Manufacturer: XILINX; Table: Logic; Part Number: XC6SLX150T-2FGG900C; Component Kind: Standard; Component Type: Standard; Device: XC6SLX150T-2FGG900C; PackageDescription: BGA,1.00mm pitch, square; 900 pin, 30 columns X 30 rows, 31.00mm X 31.00mm X 2.60mm H, IPC Medium Density; Manufacturer Part Number: XC6SLX150T-2FGG900C; Pin Count: 900; Case: BGA900; Mounted: Yes; Socket: No; SMD: Yes; ComponentHeight: 2.6mm; HelpURL: \\cern.ch\dfs\Applications\Altium\Datasheets\XC6SLX150T-2FGG900C.pdf; ComponentLink1URL: \\cern.ch\dfs\Applications\Altium\Datasheets\XC6SLX150T-2FGG900C_Package-Pinouts.pdf; ComponentLink1Description: Package/Pinouts; Author: CERN DEM JLC; CreateDate: 2009-11-17; LatestRevisionDate: 2009-11-17
LD5 LD8-LD10 = LED_ROHM_SML-311UTT86K: LED Red 1C 2A; Part Description: Low current chip LED SML-311 Serie; Manufacturer: ROHM; Table: LEDs & Displays; Part Number: LED_ROHM_SML-311UTT86K; Component Kind: Standard; Component Type: Standard; Color: Red; PackageDescription: Chip RED LED, 2-Leads, Body 1.6x0.8mm, IPC Medium Density; Manufacturer Part Number: SML-311UTT86K; Pin Count: 2; Mounted: Yes; Socket: No; SMD: Yes; ComponentHeight: 0.8mm; HelpURL: \\cern.ch\dfs\Applications\Altium\Datasheets\LED_ROHM_SML-311UTT86K.pdf; Author: CERN DEM JLC; CreateDate: 3/16/2010; LatestRevisionDate: 3/17/2010
R2 R3 R7 R126 = R0603_1K1_1%_0.1W_100PPM: Resistor - 1%; Part Description: General Purpose Thick Film Chip Resistor; Manufacturer: GENERIC; Manufacturer1 Part Number: NRC06F1101TRF; Power: 0.1W; TC: ±100ppm/°C; Table: Resistors SMD; Part Number: R0603_1K1_1%_0.1W_100PPM; Component Kind: Standard; Component Type: Standard; Pin Count: 2; Value: 1k1; Status: Preferred; Tolerance: ±1%; Manufacturer Part Number: R0603_1K1_1%_0.1W_100PPM; Case: 0603; Mounted: Yes; Socket: No; SMD: Yes; Manufacturer1 Example: NIC COMPONENT; Manufacturer1 ComponentHeight: 0.55mm; HelpURL: \\cern.ch\dfs\Applications\Altium\Datasheets\R0603_NIC_NRC.pdf; Author: CERN DEM JLC; CreateDate: 2007-12-03; LatestRevisionDate: 2008-03-13
R14 R21 = R0603_5K1_1%_0.1W_100PPM: Resistor - 1%; Part Description: General Purpose Thick Film Chip Resistor; Manufacturer: GENERIC; Manufacturer1 Part Number: NRC06F5101TRF; Power: 0.1W; TC: ±100ppm/°C; Table: Resistors SMD; Part Number: R0603_5K1_1%_0.1W_100PPM; Component Kind: Standard; Component Type: Standard; Pin Count: 2; Value: 5k1; Status: Preferred; Tolerance: ±1%; Manufacturer Part Number: R0603_5K1_1%_0.1W_100PPM; Case: 0603; Mounted: Yes; Socket: No; SMD: Yes; Manufacturer1 Example: NIC COMPONENT; Manufacturer1 ComponentHeight: 0.55mm; HelpURL: \\cern.ch\dfs\Applications\Altium\Datasheets\R0603_NIC_NRC.pdf; Author: CERN DEM JLC; CreateDate: 03/12/2007; LatestRevisionDate: 13/03/2008
R17 = R0603_0R_JUMPER: Resistor - 1%; Part Description: 1A (0.05R Max DC Resistance) Zero Ohm Jumper; Manufacturer: GENERIC; Manufacturer1 Part Number: NRC06Z0; Table: Resistors SMD; Part Number: R0603_0R_JUMPER; Component Kind: Standard; Component Type: Standard; Pin Count: 2; Value: 0; Status: Preferred; Manufacturer Part Number: R0603_0R_JUMPER; Case: 0603; Socket: No; SMD: Yes; Manufacturer1 Example: NIC COMPONENT; Manufacturer1 ComponentHeight: 0.55mm; HelpURL: \\cern.ch\dfs\Applications\Altium\Datasheets\R0603_NIC_NRC.pdf; Author: CERN DEM JLC; CreateDate: 12/3/2007; LatestRevisionDate: 3/13/2008